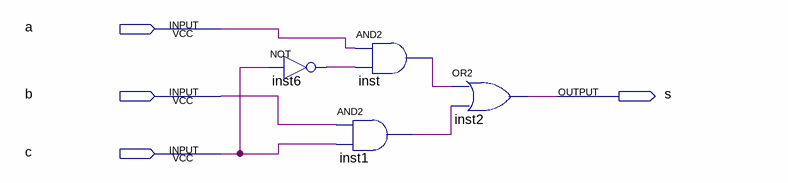
[diagram p0: schematic sheet]
// Quartus schematic mux2x1.bdf as structural Verilog: 4 symbols, 4 pins
module mux2x1 (
  input  a,
  input  b,
  input  c,
  output s
);

  wire inst1_out, inst6_out, inst_out;

  not inst6 (inst6_out, c);
  and inst1 (inst1_out, b, c);
  and inst (inst_out, a, inst6_out);
  or inst2 (s, inst_out, inst1_out);
endmodule
